# EAGLE design hamtonio (EAGLE 9.2.2)
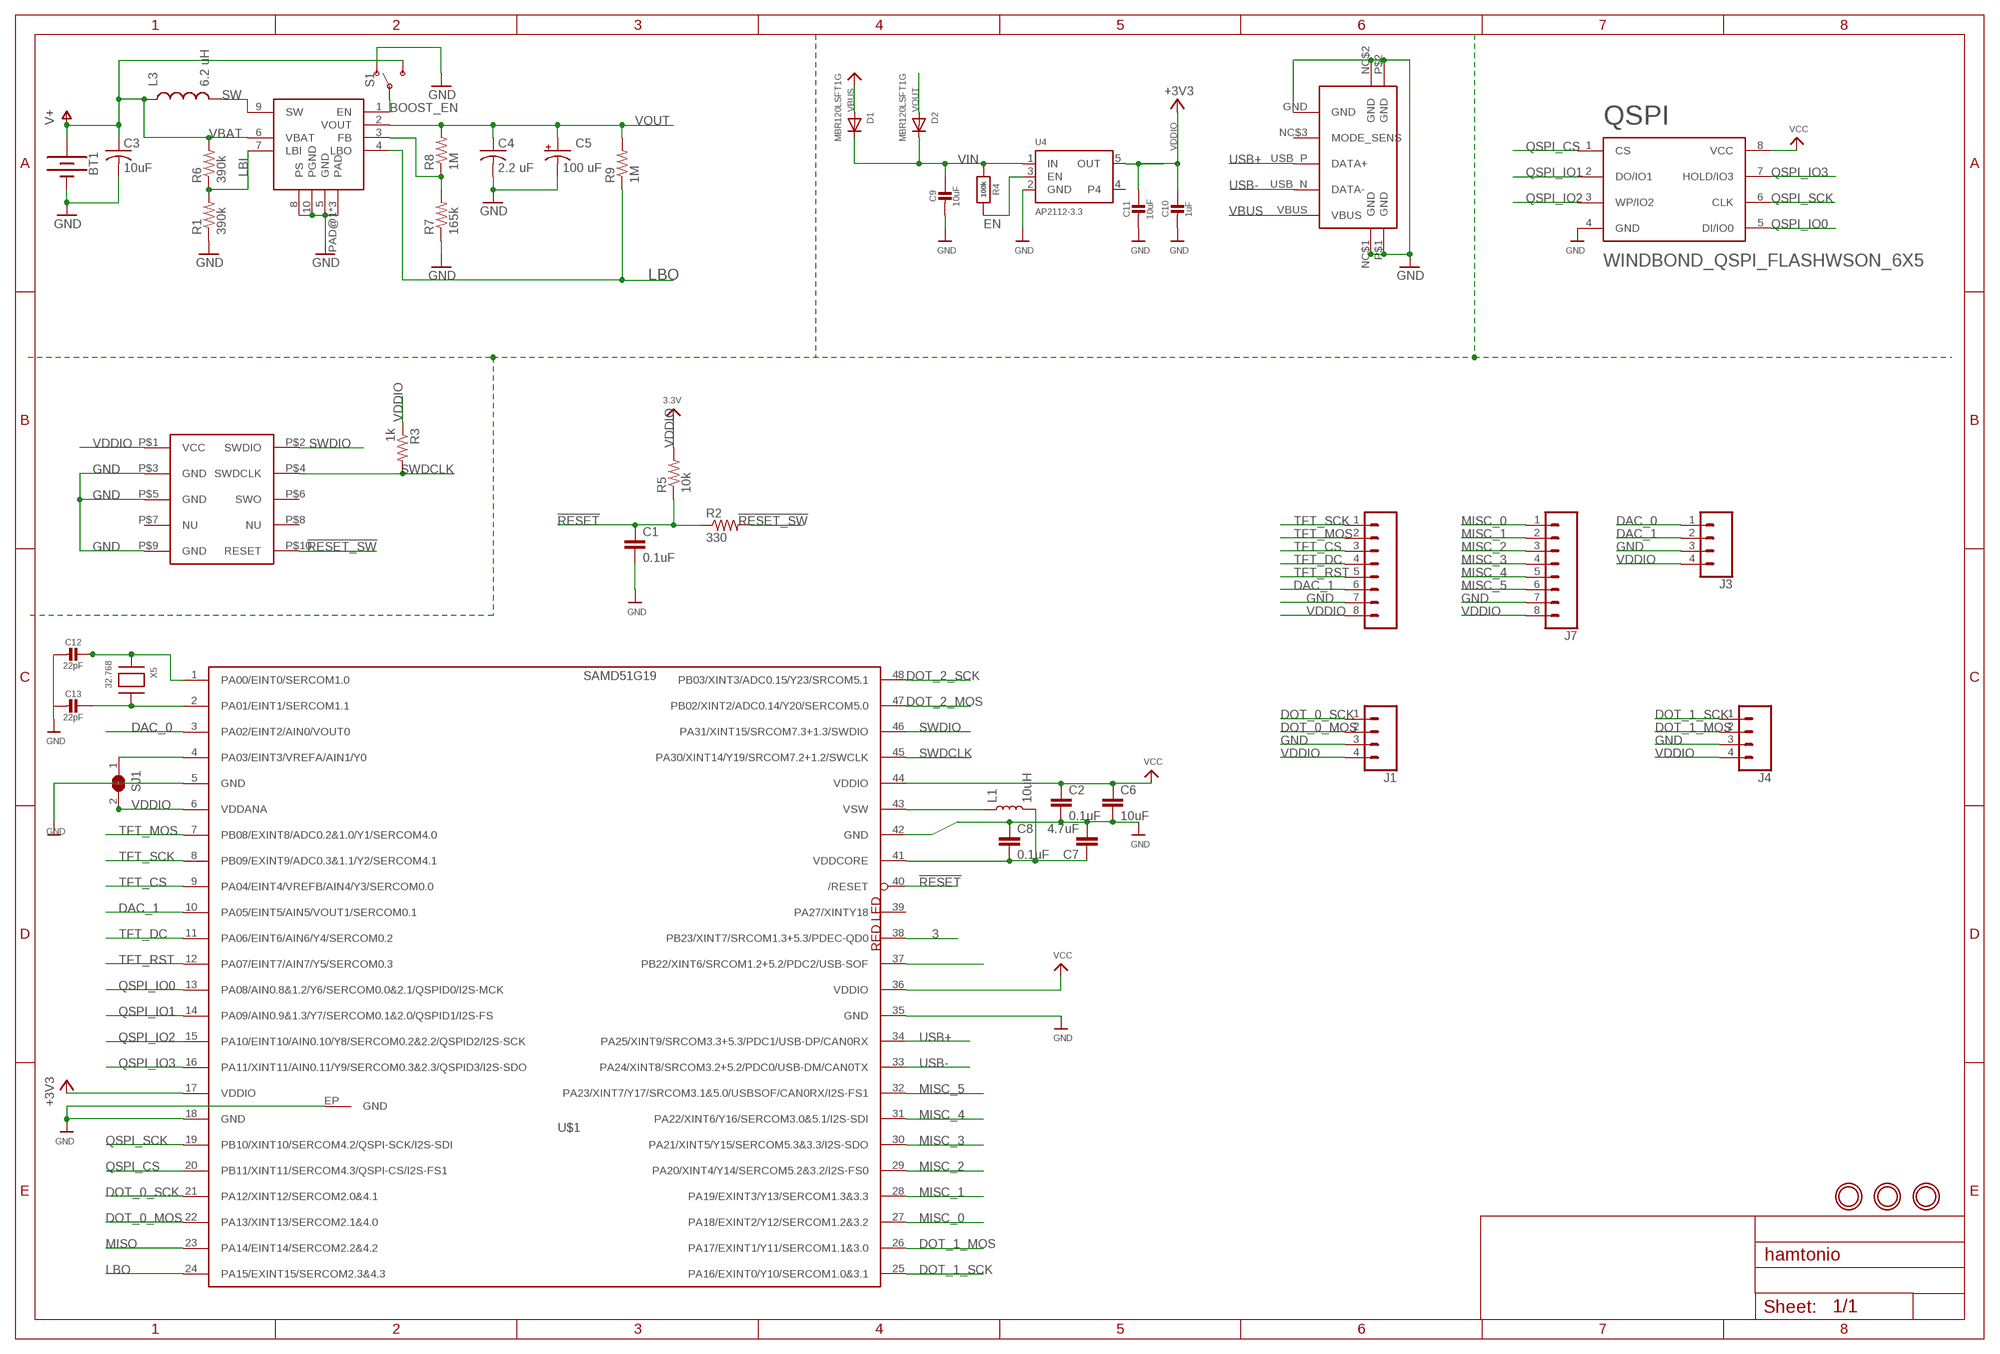
[diagram p0: schematic, sheet 1]

## Parts
BT1  BATTERYDUAL_AA_XX  [DUAL_AA]
C1  0.1uF  0.1UF-0603-25V-(+80/-20%)  [0603]
C2  0.1uF  0.1UF-0603-25V-(+80/-20%)  [0603]
C3  10uF  C-USC0805K  [C0805K]
C4  2.2 uF  C-USC0805K  [C0805K]
C5  100 uF  CPOL-USCT6032  [CT6032]
C6  10uF  10UF-0805-10V-10%  [0805]
C7  4.7uF  4.7UF0603  [0603]
C8  0.1uF  0.1UF-0603-25V-(+80/-20%)  [0603]
C9  10uF  CAP_CERAMIC0805-NOOUTLINE  [0805-NO]
C10  1uF  CAP_CERAMIC0603_NO  [0603-NO]
C11  10uF  CAP_CERAMIC0805-NOOUTLINE  [0805-NO]
C12  22pF  CAP_CERAMIC0603_NO  [0603-NO]
C13  22pF  CAP_CERAMIC0603_NO  [0603-NO]
D1  MBR120LSFT1G  DIODESOD-123  [SOD-123]
D2  MBR120LSFT1G  DIODESOD-123  [SOD-123]
J1  CONN_041X04_NO_SILK  [1X04_NO_SILK]
J3  CONN_041X04_NO_SILK  [1X04_NO_SILK]
J4  CONN_041X04_NO_SILK  [1X04_NO_SILK]
J6  CONN_08NO_SILK_FEMALE_PTH  [1X08_NO_SILK]
J7  CONN_08NO_SILK_FEMALE_PTH  [1X08_NO_SILK]
L1  10uH  1007_INDUCTOR  [1007_INDUCTOR]
L3  6.2 uH  INDUCTORSRU1038  [CDRH52D]
QSPI  WINDBOND_QSPI_FLASHWSON_6X5  [WSON_6X5MM]
R1  390k  R-US_R0603  [R0603]
R2  330  R-US_R0603  [R0603]
R3  1k  R-US_R0603  [R0603]
R4  100k  RESISTOR_0603_NOOUT  [0603-NO]
R5  10k  R-US_R0603  [R0603]
R6  390k  R-US_R0603  [R0603]
R7  165k  R-US_R0603  [R0603]
R8  1M  R-US_R0603  [R0603]
R9  1M  R-US_R0603  [R0603]
S1  SWITCH-SPDTSMD_C&K_JS  [SPDT_SMD]
SJ1  SOLDERJUMPERCLOSED  [SOLDERJUMPER_CLOSEDWIRE]
U4  AP2112-3.3  VREG_SOT23-5  [SOT23-5]
U$1  SAMD51G19  SAMD51G  [QFN-48]
U$2  SWD_HEADER  [AMPHENOL_SWD]
U$8  TPS61029  [TPS61029]
U$12  AMPHENOL_MICRO_USBAMPHENOL_MICRO_USB_BETTER  [BETTER_AMP_MICRO_USB]
U$22  MOUNTINGHOLE2.5  [MOUNTINGHOLE_2.5_PLATED]
U$34  MOUNTINGHOLE2.5  [MOUNTINGHOLE_2.5_PLATED]
U$39  MOUNTINGHOLE2.5  [MOUNTINGHOLE_2.5_PLATED]
X5  32.768  XTAL-3.2X1.5  [XTAL3215]

## Nets
3: U$1.38(PB23/XINT7/SRCOM1.3+5.3/PDEC-QD0)
!RESET: C1.1 R2.1 R5.1 U$1.40(/RESET)
!RESET_SW: R2.2 U$2.P$10(RESET)
AREF: SJ1.1 U$1.4(PA03/EINT3/VREFA/AIN1/Y0)
BOOST_EN: S1.P$2(P) S1.P$5(P) U$8.1(EN)
DAC_0: J3.1 U$1.3(PA02/EINT2/AIN0/VOUT0)
DAC_1: J3.2 J6.6 U$1.10(PA05/EINT5/AIN5/VOUT1/SERCOM0.1)
DOT_0_MOS: J1.2 U$1.22(PA13/XINT13/SERCOM2.1&4.0)
DOT_0_SCK: J1.1 U$1.21(PA12/XINT12/SERCOM2.0&4.1)
DOT_1_MOS: J4.2 U$1.26(PA17/EXINT1/Y11/SERCOM1.1&3.0)
DOT_1_SCK: J4.1 U$1.25(PA16/EXINT0/Y10/SERCOM1.0&3.1)
DOT_2_MOS: U$1.47(PB02/XINT2/ADC0.14/Y20/SERCOM5.0)
DOT_2_SCK: U$1.48(PB03/XINT3/ADC0.15/Y23/SRCOM5.1)
EN: R4.2 U4.3(EN)
FB: R7.2 R8.1 U$8.3(FB)
GND: BT1.V-(-) C1.2 C2.2 C3.2 C4.2 C5.- C6.2 C7.2 C8.1 C9.2 C10.2 C11.2 C12.2 C13.2 J1.3 J3.3 J4.3 J6.7 J7.7 QSPI.4(GND) R1.1 R7.1 S1.P$1(O) S1.P$6(O) U4.2(GND) U$1.5(GND) U$1.18(GND) U$1.35(GND) U$1.42(GND) U$1.EP(GND) U$2.P$3(GND) U$2.P$5(GND) U$2.P$9(GND) U$8.5(GND) U$8.8(PS) U$8.10(PGND) U$8.PAD@1(PAD) U$8.PAD@2(PAD) U$8.PAD@3(PAD) U$12.GND U$12.NC$1(GND) U$12.NC$2(GND) U$12.P$1(GND) U$12.P$2(GND)
LBI: R1.2 R6.1 U$8.7(LBI)
LBO: R9.1 U$1.24(PA15/EXINT15/SERCOM2.3&4.3) U$8.4(LBO)
MISC_0: J7.1 U$1.27(PA18/EXINT2/Y12/SERCOM1.2&3.2)
MISC_1: J7.2 U$1.28(PA19/EXINT3/Y13/SERCOM1.3&3.3)
MISC_2: J7.3 U$1.29(PA20/XINT4/Y14/SERCOM5.2&3.2/I2S-FS0)
MISC_3: J7.4 U$1.30(PA21/XINT5/Y15/SERCOM5.3&3.3/I2S-SDO)
MISC_4: J7.5 U$1.31(PA22/XINT6/Y16/SERCOM3.0&5.1/I2S-SDI)
MISC_5: J7.6 U$1.32(PA23/XINT7/Y17/SRCOM3.1&5.0/USBSOF/CAN0RX/I2S-FS1)
MISO: U$1.23(PA14/EINT14/SERCOM2.2&4.2)
N$3: U$1.37(PB22/XINT6/SRCOM1.2+5.2/PDC2/USB-SOF)
QSPI_CS: QSPI.1(CS) U$1.20(PB11/XINT11/SERCOM4.3/QSPI-CS/I2S-FS1)
QSPI_IO0: QSPI.5(DI/IO0) U$1.13(PA08/AIN0.8&1.2/Y6/SERCOM0.0&2.1/QSPID0/I2S-MCK)
QSPI_IO1: QSPI.2(DO/IO1) U$1.14(PA09/AIN0.9&1.3/Y7/SERCOM0.1&2.0/QSPID1/I2S-FS)
QSPI_IO2: QSPI.3(WP/IO2) U$1.15(PA10/EINT10/AIN0.10/Y8/SERCOM0.2&2.2/QSPID2/I2S-SCK)
QSPI_IO3: QSPI.7(HOLD/IO3) U$1.16(PA11/XINT11/AIN0.11/Y9/SERCOM0.3&2.3/QSPID3/I2S-SDO)
QSPI_SCK: QSPI.6(CLK) U$1.19(PB10/XINT10/SERCOM4.2/QSPI-SCK/I2S-SDI)
SW: L3.2 U$8.9(SW)
SWDCLK: R3.2 U$1.45(PA30/XINT14/Y19/SRCOM7.2+1.2/SWCLK) U$2.P$4(SWDCLK)
SWDIO: U$1.46(PA31/XINT15/SRCOM7.3+1.3/SWDIO) U$2.P$2(SWDIO)
TFT_CS: J6.3 U$1.9(PA04/EINT4/VREFB/AIN4/Y3/SERCOM0.0)
TFT_DC: J6.4 U$1.11(PA06/EINT6/AIN6/Y4/SERCOM0.2)
TFT_MOS: J6.2 U$1.7(PB08/EXINT8/ADC0.2&1.0/Y1/SERCOM4.0)
TFT_RST: J6.5 U$1.12(PA07/EINT7/AIN7/Y5/SERCOM0.3)
TFT_SCK: J6.1 U$1.8(PB09/EXINT9/ADC0.3&1.1/Y2/SERCOM4.1)
USB+: U$1.34(PA25/XINT9/SRCOM3.3+5.3/PDC1/USB-DP/CAN0RX) U$12.USB_P(DATA+)
USB-: U$1.33(PA24/XINT8/SRCOM3.2+5.2/PDC0/USB-DM/CAN0TX) U$12.USB_N(DATA-)
VBAT: BT1.V+(+) C3.1 L3.1 R6.2 S1.P$3(S) S1.P$4(S) U$8.6(VBAT) ; supply symbol labelled V+
VBUS: D1.A U$12.VBUS
VDDCORE: C7.1 C8.2 L1.P$2 U$1.41(VDDCORE)
VDDIO: C2.1 C6.1 C10.1 C11.1 J1.4 J3.4 J4.4 J6.8 J7.8 QSPI.8(VCC) R3.1 R5.2 SJ1.2 U4.5(OUT) U$1.6(VDDANA) U$1.17(VDDIO) U$1.36(VDDIO) U$1.44(VDDIO) U$2.P$1(VCC) ; supply symbol labelled VCC, +3V3, 3.3V
VIN: C9.1 D1.C D2.C R4.1 U4.1(IN)
VOUT: C4.1 C5.+ D2.A R8.2 R9.2 U$8.2(VOUT)
VSW: L1.P$1 U$1.43(VSW)
XOSC32_A: C12.1 U$1.1(PA00/EINT0/SERCOM1.0) X5.P$1
XOSC32_B: C13.1 U$1.2(PA01/EINT1/SERCOM1.1) X5.P$2
Unconnected: U4.4 U$1.39(PA27/XINTY18) U$2.P$6(SWO) U$2.P$7(NU) U$2.P$8(NU) U$12.NC$3(MODE_SENS)

## Notes on the sheet
- Dev Board Starter Kit
- RED LED

## Library data of the parts
BT1 = 00_bsiepert:BATTERY: Battery - Single Cell A variety of battery chemistries, sizes, and footprints. Device List: 20MM_PTH - Coin Cell Battery Holder - 20mm (PTH) <https://www.sparkfun.com/products/783> 6.8MM_PTH - Coin Cell Battery Holder - 6.8MM(SMD) <https://www.digikey.com/product-detail/en/seiko-instruments/MS621FE-FL11E/728-1057-ND/1889208?WT.srch=1&gclid=CNOQ5a6LzdQCFZS2wAodXCkE0g> 12MM_SMD - Coin Cell Battery Holder - 12mm (SMD) <https://www.sparkfun.com/products/10592> 12MM_PTH - Coin Cell Battery Holder - 12mm (PTH) <https://www.sparkfun.com/products/7948> 20MM_SMD - 20mm Coin Cell Battery Holder (SMD) (2 legs) Used on the Big Time Watch Kit <https://www.sparkfun.com/products/11734> 20MM_SMD_4LEGS - Coin Cell Battery Holder - 20mm (SMD) <https://www.sparkfun.com/products/11892> 20MM_SMD_4LEGS_OVERPASTE - Coin Cell Battery Holder - 20mm (SMD) <https://www.sparkfun.com/products/11892> (Over-paste on the legs) 24.5MM_PTH - Coin Cell Battery Holder - 24.5mm (PTH) <https://www.sparkfun.com/products/8863> 9V - 9V Battery Holder - PC Mount Used on the SparkFun SparkPunk Sound Kit <https://www.sparkfun.com/products/11177> and SparkFun SparkPunk Sequencer Kit <https://www.sparkfun.com/products/12707> 18650 - Battery Holder - 18650 (PTH) <https://www.sparkfun.com/products/13113> AA - Battery Holder - 1xAA (PTH) <https://www.sparkfun.com/products/7949> AAA - Battery Holder - 1xAAA (PTH) <https://www.sparkfun.com/products/12718> AA_KIT - Battery Holder - 1xAA (PTH) <https://www.sparkfun.com/products/7949> Special kit package - pads only have exposed copper on one side of the board. AAA_KIT - Battery Holder - 1xAAA (PTH) <https://www.sparkfun.com/products/12718> Special kit package - pads only have exposed copper on one side of the board.
C1 C2 C8 = SparkFun-Capacitors:0.1UF: 0.1µF ceramic capacitors A capacitor is a passive two-terminal electrical component used to store electrical energy temporarily in an electric field.; PROD_ID: CAP-00810
C3 C4 = resistor:C-US: CAPACITOR, American symbol
C5 = resistor:CPOL-US: POLARIZED CAPACITOR, American symbol
C6 = SparkFun-Capacitors:10UF: 10.0µF ceramic capacitors A capacitor is a passive two-terminal electrical component used to store electrical energy temporarily in an electric field.; PROD_ID: CAP-11330
C7 = SparkFun-Capacitors:4.7UF: 4.7µF ceramic capacitors A capacitor is a passive two-terminal electrical component used to store electrical energy temporarily in an electric field.; PROD_ID: CAP-08280
C9-C13 = microbuilder:CAP_CERAMIC: Ceramic Capacitors For new designs, use the packages preceded by an '_' character since they are more reliable: The following footprints should be used on most boards: _0402 - Standard footprint for regular board layouts _0603 - Standard footprint for regular board layouts _0805 - Standard footprint for regular board layouts _1206 - Standard footprint for regular board layouts For extremely tight-pitch boards where space is at a premium, the following 'micro-pitch' footprints can be used (smaller pads, no silkscreen outline, etc.): _0402MP - Micro-pitch footprint for very dense/compact boards _0603MP - Micro-pitch footprint for very dense/compact boards _0805MP - Micro-pitch footprint for very dense/compact boards _1206MP - Micro-pitch footprint for very dense/compact boards
D1 D2 = adafruit:DIODE: Diode SMADIODE - SMA Surface Mount Package 20V 1A Schottky Diode Digikey: 641-1014-6-ND DO-1N4148 - Through Hole Small Current Diode SOD-123 20V 1 A (.5mV Vf) Schottky Diode - Digikey: MBRX120TPMSCT-ND SOD-323 10V 570mA (.38mV Vf, 3ns) Schottky Diode - Digikey: ZLLS410CT-ND SOD-523 30V 30mA Schottky Diode (RB751S-40TE61) - Digikey: RB751S-40TE61CT-ND SOT23-R/W - SOT23 Package (R = Solder Paste/Reflow Ovens, W = Hand-Soldering) BAT54Film 40V 300mA - Digikey: 497-7162-1-ND
J1 J3 J4 = SparkFun-Connectors:CONN_04: Multi connection point. Often used as Generic Header-pin footprint for 0.1 inch spaced/style header connections On any of the 0.1 inch spaced packages, you can populate with these: Break Away Headers - Straight <https://www.sparkfun.com/products/116> (PRT-00116) Break Away Male Headers - Right Angle <https://www.sparkfun.com/products/553> (PRT-00553) Female Headers <https://www.sparkfun.com/products/115> (PRT-00115) Break Away Headers - Machine Pin <https://www.sparkfun.com/products/117> (PRT-00117) Break Away Female Headers - Swiss Machine Pin <https://www.sparkfun.com/products/743> (PRT-00743) For SCREWTERMINALS and SPRING TERMINALS visit here: Screw Terimnals on SparkFun.com <https://www.sparkfun.com/search/results?term=Screw+Terminals> (5mm/3.5mm/2.54mm spacing) This device is also useful as a general connection point to wire up your design to another part of your project. Our various solder wires solder well into these plated through hole pads. Hook-Up Wire - Assortment (Stranded, 22 AWG) <https://www.sparkfun.com/products/11375> (PRT-11375) Hook-Up Wire - Assortment (Solid Core, 22 AWG) <https://www.sparkfun.com/products/11367> (PRT-11367) View the entire wire category on our website here <https://www.sparkfun.com/categories/141> Special notes: Molex polarized connector foot print use with SKU : PRT-08231 with associated crimp pins and housings. 1MM SMD Version SKU: PRT-10208; PROD_ID: CONN-09696
J6 J7 = SparkFun-Connectors:CONN_08: Multi connection point. Often used as Generic Header-pin footprint for 0.1 inch spaced/style header connections On any of the 0.1 inch spaced packages, you can populate with these: Break Away Headers - Straight <https://www.sparkfun.com/products/116> (PRT-00116) Break Away Male Headers - Right Angle <https://www.sparkfun.com/products/553> (PRT-00553) Female Headers <https://www.sparkfun.com/products/115> (PRT-00115) Break Away Headers - Machine Pin <https://www.sparkfun.com/products/117> (PRT-00117) Break Away Female Headers - Swiss Machine Pin <https://www.sparkfun.com/products/743> (PRT-00743) Arduino Stackable Header - 8 Pin <https://www.sparkfun.com/products/9279> (PRT-09279) For SCREWTERMINALS and SPRING TERMINALS visit here: Screw Terimnals on SparkFun.com <https://www.sparkfun.com/search/results?term=Screw+Terminals> (5mm/3.5mm/2.54mm spacing) This device is also useful as a general connection point to wire up your design to another part of your project. Our various solder wires solder well into these plated through hole pads. Hook-Up Wire - Assortment (Stranded, 22 AWG) <https://www.sparkfun.com/products/11375> (PRT-11375) Hook-Up Wire - Assortment (Solid Core, 22 AWG) <https://www.sparkfun.com/products/11367> (PRT-11367) View the entire wire category on our website here <https://www.sparkfun.com/categories/141> Special notes: Molex polarized connector foot print use with SKU : PRT-08231 with associated crimp pins and housings. 1MM SMD Version SKU: PRT-10208 NOTES ON THE VARIANTS LOCK and LOCK_LONGPADS... This footprint was designed to help hold the alignment of a through-hole component (i.e. 6-pin header) while soldering it into place. You may notice that each hole has been shifted either up or down by 0.005 of an inch from it's more standard position (which is a perfectly straight line). This slight alteration caused the pins (the squares in the middle) to touch the edges of the holes. Because they are alternating, it causes a "brace" to hold the component in place. 0.005 has proven to be the perfect amount of "off-center" position when using our standard breakaway headers. Although looks a little odd when you look at the bare footprint, once you have a header in there, the alteration is very hard to notice. Also,if you push a header all the way into place, it is covered up entirely on the bottom side.; PROD_ID: CONN-08438
L1 = 00_bsiepert:1007_INDUCTOR
L3 = Inductor-SumidaCDRH5D28:INDUCTOR: Inductors Basic Inductor/Choke - 0603 and 1206. Footprints are not proven and vary greatly between part numbers.
QSPI = 00_bsiepert:WINDBOND_QSPI_FLASH
R1-R3 R5-R9 = adafruit:R-US_: RESISTOR, American symbol
R4 = microbuilder:RESISTOR: Resistors For new designs, use the packages preceded by an '_' character since they are more reliable: The following footprints should be used on most boards: _0402 - Standard footprint for regular board layouts _0603 - Standard footprint for regular board layouts _0805 - Standard footprint for regular board layouts _1206 - Standard footprint for regular board layouts For extremely tight-pitch boards where space is at a premium, the following 'micro-pitch' footprints can be used (smaller pads, no silkscreen outline, etc.): _0402MP - Micro-pitch footprint for very dense/compact boards _0603MP - Micro-pitch footprint for very dense/compact boards _0805MP - Micro-pitch footprint for very dense/compact boards _1206MP - Micro-pitch footprint for very dense/compact boards
S1 = 00_bsiepert:SWITCH-SPDT: Single Pole, Double Throw (SPDT) Switch Single-pole, double-throw (SPDT) switch. Variant Overview SMD-AYZ0202 Surface Mount DPDT Switch <https://www.sparkfun.com/products/597> (COM-00597) Used on e.g. LilyPad Arduino USB - ATmega32U4 Board <https://www.sparkfun.com/products/12049> PTH-11.6X4.0MM SPDT Mini Power Switch <https://www.sparkfun.com/products/102> (COM-00102) Used on e.g. SparkFun Simon Says - Through-Hole Soldering Kit <https://www.sparkfun.com/products/10547> (KIT-10547) PTH-11.6X4.0MM-KIT KIT version of SPDT Mini Power Switch - Simplifies soldering by removing tStop of switch pins - only one side can be soldered. PTH-11.6X4.0MM-LOCK LOCK version of SPDT Mini Power Switch - Offset pins hold switch in place for easier soldering. SMD-RIGHT-ANGLE Surface Mount Right Angle Switch <https://www.sparkfun.com/products/10860> (COM-10860) Used on e.g. SparkFun ESP8266 Thing <https://www.sparkfun.com/products/13231>
SJ1 = 00_bsiepert:SOLDERJUMPER: SMD Solder JUMPER Solder the two pads together to create a connection, or remove the solder to break it. REFLOW - Use this footprint for solder paste and reflow ovens. WAVE - Use this footprint for hand-soldering (larger pads). CLOSED - Has a trace between the two pads to ensure it is closed by default. The trace needs to be cut to disable the jumper, and can be closed again by creating a solder bridge between the two pads.
U4 = microbuilder:VREG_SOT23-5: SOT23-5 Fixed Voltage Regulators Part Current Out V Out V In V Dropout θJA (°C/W) TJ (°C) Digikey Part No. ADP121 150mA 3.3V 3.4-5.5V 0.09V @ 150mA -- -- ADP121-AUJZ33R7CT-ND ADP121 150mA 3.0V 3.1-5.5V 0.09V @ 150mA -- -- ADP121-AUJZ30R7CT-ND ADP122 300mA 3.3V 3.4-5.5V 0.085V @ 300mA -- -- ADP122AUJZ-3.3-R7CT-ND ADP1712 300mA 3.3V 3.5-5.5V 0.17V @ 300mA -- -- ADP1712AUJZ-3.3-R7TR-ND AP7311 (Low Cost) 150mA 3.3V 3.5-6V 0.15V @ 150mA -- -- AP7311-33WG-7DICT-ND LD39015M18R 150mA 1.8V 1.9V-5.5V 0.08V @ 100mA -- -- 497-6977-1-ND LP2985A-33DBVR 150mA 3.3V 3.3-16V 0.28V @ 150mA 206 150 296-18479-1-ND MCP1824T-3302E/OT 300mA 3.3V 3.5V-6V 0.2V @ 300mA -- -- MCP1824T-3302E/OTCT-ND MIC5205-2.5YM5 TR 150mA 2.5V 2.7-16V 0.165V @ 150mA -- -- 576-1257-2-ND MIC5205-3.0YM5 TR 150mA 3.0V 3.2V-16V 0.165V @ 150mA -- -- 576-1258-2-ND MIC5205-3.3YM5 TR 150mA 3.3V 3.5V-16V 0.165V @ 150mA -- -- 576-1259-2-ND TPS780330220 150mA 3.3V+2.2V 3.6-5.5V 250mV Max -- -- 296-23332-1-ND TDA3663/N1,135 100mA 3.3V 3.5-45V 0.18V @ 50mA -- -- 568-5343-1-ND Max operating temp can be calculated using θJA, TJ (max junction temperature), and power in watts. Set the "Maximum Ambient Temperature" until it reaches TJ ("Max Junction Temperature"), which is the absolute limit for safe use of the regulator: Heat Sink Temperature Calculator <http://www.daycounter.com/Calculators/Heat-Sink-Temperature-Calculator.phtml> For example, With 12V source into a 3.3V LP2985 and a 30mA load, we are dissipating (12V-3.3V) * 0.03A = 0.261W. With a θJA of 206 °C/W, a TJ of 150°C, and 261mW we can safely use the chip without a heat sink up to 75°C (=147.1°C Junction Temperature).
U$1 = 00_bsiepert:SAMD51G
U$2 = 00_bsiepert:SWD_HEADER
U$8 = 00_bsiepert:TPS61029
U$12 = 00_bsiepert:AMPHENOL_MICRO_USB
U$22 U$34 U$39 = microbuilder:MOUNTINGHOLE: Mounting Hole For #2 screws (0.086"/2.18mm width, 0.094"/2.4mm hole) use 2.5mm; BOM: EXCLUDE
X5 = adafruit2:XTAL: Low cost SMT crystals, no capacitors included http://www.ladyada.net/library/eagle

## Net classes
1 vcc: width 0.254 mm

## Board
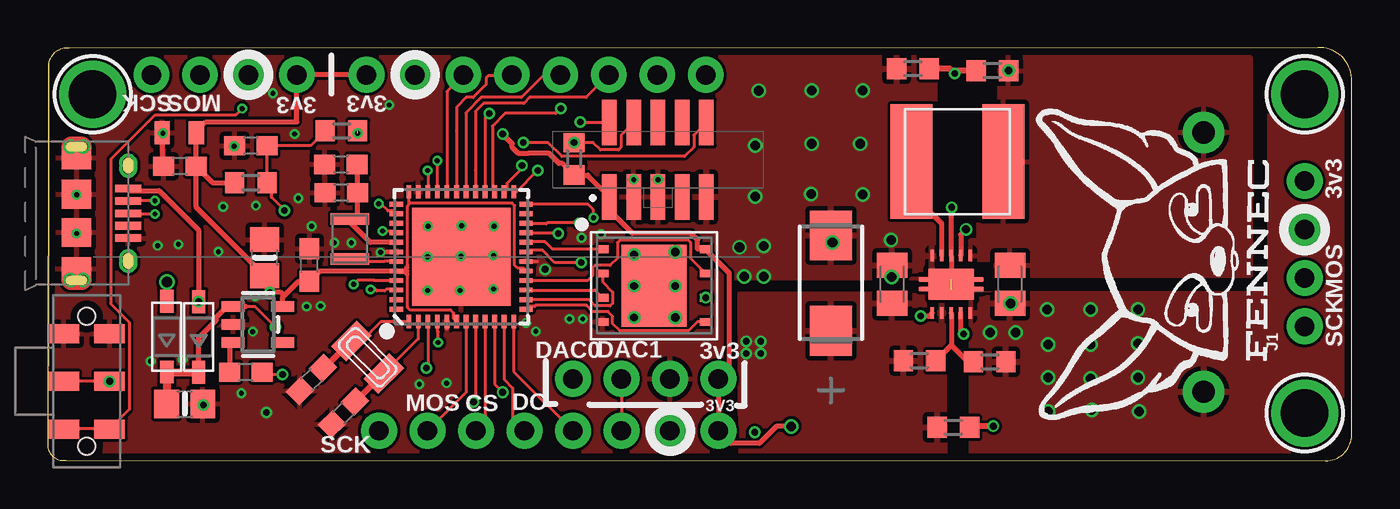
[diagram p1: board, top side]
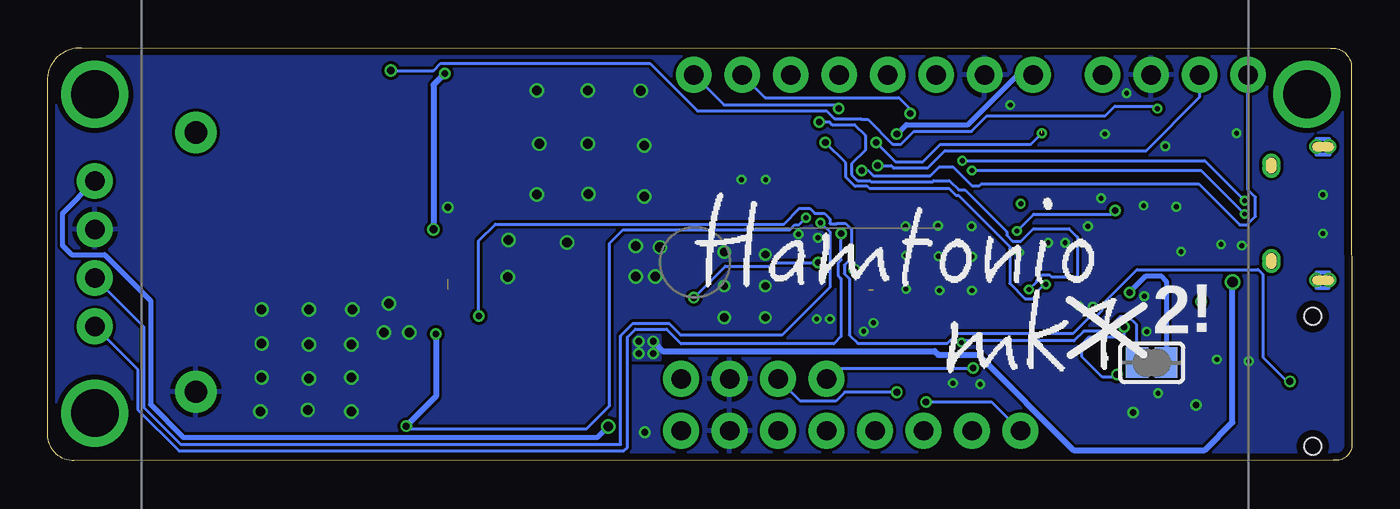
[diagram p2: board, bottom side, seen from below]

Size 68.34 x 21.64 mm. Coordinates in mm from the lower left corner, seen from the top.
Outline: 0.03,20.73 0,0.76 arc90 0.97,0.03 66.95,0 arc90 68.34,1.37 68.34,20.04 arc90 66.55,21.64 1.12,21.62 arc90 0.03,20.73
Copper layers (1*16): Top 0.035559375mm / dielectric 1.6mm / Bottom 0.035559375mm
Design rules "oshpark-2layer-tented *": minimum track width 6mil, minimum drill 10mil, track to track 6mil, track to pad 6mil, pad to pad 6mil, via to via 6mil, smd to smd 6mil, copper to edge 15mil, drill to drill 6mil, minimum pad ring 5mil, minimum via ring 5mil, stop-mask expansion 2.5mil, vias tented up to drill 20mil, thermal gap 10mil

### Footprints (pad centres in the part's own frame; a part is rotated, then mirrored left to right if it is on the bottom)
DUAL_AA = drill 1.17 pad 2.184: V+ 6.795,26.16; V- -6.795,26.16
0603 = smd 1.1 x 1: 1 -0.85,0; 2 0.85,0
C0805K = smd 1.3 x 1.6: 1 -1,0; 2 1,0
CT6032 = smd 2.6 x 2.2: + 2.5,0; - -2.5,0
0805 = smd 0.8 x 1.2: 1 -0.9,0; 2 0.9,0
0805-NO = smd 1.3 x 1.5: 1 -0.95,0; 2 0.95,0
0603-NO = smd 1.1 x 1: 1 -0.85,0; 2 0.85,0
SOD-123 = smd 1.2 x 0.7: A 1.85,0; C -1.85,0
1X04_NO_SILK = drill 1.016 pad 1.88: 1 0,0; 2 2.54,0; 3 5.08,0; 4 7.62,0
1X08_NO_SILK = drill 1.016 pad 1.88: 1 0,0; 2 2.54,0; 3 5.08,0; 4 7.62,0; 5 10.16,0; 6 12.7,0; 7 15.24,0; 8 17.78,0
1007_INDUCTOR = smd 0.6 x 2: P$1 -1.05,0; P$2 1.05,0
CDRH52D = smd 2.2 x 6: 1 -2.4,0; 2 2.4,0
WSON_6X5MM = smd 0.6 x 0.4: 1 -2.7,1.905; 2 -2.7,0.635; 3 -2.7,-0.635; 4 -2.7,-1.905; 5 2.7,-1.905; 6 2.7,-0.635; 7 2.7,0.635; 8 2.7,1.905 | smd 3.4 x 4.3: PAD 0,0
R0603 = smd 1 x 1.1: 1 -0.85,0; 2 0.85,0
SPDT_SMD = smd 1 x 1.6: P$1 -2.5,1.2; P$2 0,1.2; P$3 2.5,1.2; P$4 2.5,-1.2; P$5 0,-1.2; P$6 -2.5,-1.2 | hole 0.9: 3.4,0; -3.4,0
SOLDERJUMPER_CLOSEDWIRE = smd 1.168 x 1.6: 1 -0.762,0; 2 0.762,0 | smd 0.635 x 0.203: WIRE 0,0
SOT23-5 = smd 0.55 x 1.2: 1 -0.95,-1.3; 2 0,-1.3; 3 0.95,-1.3; 4 0.95,1.3; 5 -0.95,1.3
QFN-48 = smd 0.7 x 0.25: 1 -3.4,2.75; 2 -3.4,2.25; 3 -3.4,1.75; 4 -3.4,1.25; 5 -3.4,0.75; 6 -3.4,0.25; 7 -3.4,-0.25; 8 -3.4,-0.75; 9 -3.4,-1.25; 10 -3.4,-1.75; 11 -3.4,-2.25; 12 -3.4,-2.75; 25 3.4,-2.75; 26 3.4,-2.25; 27 3.4,-1.75; 28 3.4,-1.25; 29 3.4,-0.75; 30 3.4,-0.25; 31 3.4,0.25; 32 3.4,0.75; 33 3.4,1.25; 34 3.4,1.75; 35 3.4,2.25; 36 3.4,2.75 | smd 0.25 x 0.7: 13 -2.75,-3.4; 14 -2.25,-3.4; 15 -1.75,-3.4; 16 -1.25,-3.4; 17 -0.75,-3.4; 18 -0.25,-3.4; 19 0.25,-3.4; 20 0.75,-3.4; 21 1.25,-3.4; 22 1.75,-3.4; 23 2.25,-3.4; 24 2.75,-3.4; 37 2.75,3.4; 38 2.25,3.4; 39 1.75,3.4; 40 1.25,3.4; 41 0.75,3.4; 42 0.25,3.4; 43 -0.25,3.4; 44 -0.75,3.4; 45 -1.25,3.4; 46 -1.75,3.4; 47 -2.25,3.4; 48 -2.75,3.4 | smd 5.15 x 5.15: EP 0,0
AMPHENOL_SWD = smd 0.76 x 2.4: P$1 -2.54,-1.95; P$2 -2.54,1.95; P$3 -1.27,-1.95; P$4 -1.27,1.95; P$5 0,-1.95; P$6 0,1.95; P$7 1.27,-1.95; P$8 1.27,1.95; P$9 2.54,-1.95; P$10 2.54,1.95
TPS61029 = smd 0.6 x 0.24: 1 -1.5,1; 2 -1.5,0.5; 3 -1.5,0; 4 -1.5,-0.5; 5 -1.5,-1; 6 1.5,-1; 7 1.5,-0.5; 8 1.5,0; 9 1.5,0.5; 10 1.5,1 | smd 1.65 x 2.4: PAD@1 0,0 | smd 0.25 x 3.4: PAD@2 -0.25,0; PAD@3 0.25,0
BETTER_AMP_MICRO_USB = smd 0.4 x 1.35: GND 1.3,2.7; NC$3 0.65,2.7; USB_N -0.65,2.7; USB_P 0,2.7; VBUS -1.3,2.7 | smd 1.5 x 1.55: NC$1 -1,0; NC$2 1,0 | smd 1.2 x 1.55: P$1 -2.9,0; P$2 2.9,0 | drill 0.5: P$3 -3.5,0.325; P$4 -3.5,-0.325; P$5 3.5,-0.325; P$6 3.5,0.325 | drill 0.55 pad 0.95: P$7 -2.65,2.7; P$8 -2.35,2.7; P$9 2.35,2.7; P$10 2.65,2.7
MOUNTINGHOLE_2.5_PLATED = drill 2.5 pad 3.2: P$1 0,0
XTAL3215 = smd 1.1 x 1.9: P$1 1.2,0; P$2 -1.2,0

### Placement (x,y rotation side)
BT1  34.42,10.41 90 bottom
C1  10.65,16.51 180 top
C2  13.71,10.25 90 top
C3  50.43,9.25 270 top
C4  44.25,9.25 90 top
C5  41.04,9.31 270 top
C6  6.9,17.18 180 top
C7  15.38,14.05 180 top
C8  15.37,15.53 0 top
C9  7.18,2.98 0 top
C10  6.93,15.44 180 top
C11  11.37,10.64 90 top
C12  13.81,4.26 225 top
C13  15.5,2.52 225 top
D1  7.91,6.49 90 top
D2  6.24,6.5 90 top
J1  65.87,7.04 90 top
J3  27.52,4.29 0 top
J4  5.44,20.22 0 top
J6  17.36,1.57 0 top
J7  34.48,20.22 180 top
L1  15.84,11.62 90 top
L3  47.67,15.68 180 top
QSPI  31.78,9.18 0 top
R1  45.34,20.55 0 top
R2  15.4,17.28 0 top
R3  27.59,15.82 90 top
R4  10.38,4.64 180 top
R5  10.65,14.57 180 top
R6  49.51,20.45 0 top
R7  49.37,5.18 180 top
R8  45.68,5.25 180 top
R9  47.46,1.75 180 top
S1  2.05,4.17 270 top
SJ1  10.49,5.14 0 bottom
U4  11.02,7.14 270 top
U$1  21.67,10.69 90 top
U$2  31.98,15.77 0 top
U$8  47.35,9.25 90 top
U$12  1.51,12.97 270 top
U$22  65.87,2.5 270 top
U$34  65.87,19.2 270 top
U$39  2.35,19.2 270 top
X5  16.76,5.43 135 top

### Tracks (layer width: path | path; a pad name or v marks a point on that pad's centre or on a via)
3  (via drill 0.25)
  Top 0.152: U$1.38 18.13,13.09 17.83,13.09 17.45,13.47 v17.35,13.47
!RESET  (via drill 0.25, 0.35)
  Top 0.152: U$1.40 18.18,12.04 v17.55,12.04 | v12.41,13.12 11.73,13.8 11.73,14.33 R5.1 C1.1 13.77,16.51 R2.1
  Bottom 0.152: v17.55,12.04 16.67,12.93 12.6,12.93 v12.41,13.12
!RESET_SW  (via drill 0.25, 0.35)  (1 unrouted)
  Top 0.152: U$2.P$10 33.86,17.06 33.86,16.43 33.38,15.95 26.94,15.95 26.21,16.68 v24.92,16.68
  Bottom 0.152: v24.92,16.68 23.9,15.66 22.48,15.66 21.56,16.57 16.83,16.57 v16.25,17.16
AREF  (via drill 0.25)
  Top 0.152: v20.46,6.2 20.46,6.75 20.44,6.77 20.44,7.25 20.41,7.27
  Top 0.2: 20.41,7.27 20.42,7.28 U$1.4
  Bottom 0.152: SJ1.1 11.28,5.17 11.28,7.12 11.71,7.55 12.15,7.55 12.9,6.8 14.05,6.8 14.56,6.29 20.37,6.29 v20.46,6.2
BOOST_EN  (via drill 0.35)
  Top 0.152: S1.P$2 S1.P$5
  Top 0.254: v45.75,7.59 45.77,7.57 46.17,7.57 U$8.1
  Bottom 0.152: v45.75,7.59 45.75,11.53 44.87,12.41 29.76,12.41 28.95,13.22 28.4,13.22 28.14,12.96 27.64,12.96 27.36,12.68 27.36,12.45 27.33,12.42 27,12.42 26.98,12.44 26.54,12.44 26.23,12.13 26.23,10.62 26.59,10.25 26.59,9.81 26.33,9.55 26.33,6.59 25.89,6.15 21.19,6.15 20.66,6.68 14.59,6.68 13.67,7.61 13.37,7.61 13.08,7.89 13.08,8.19 11.26,10.01 4.93,10.01 4.92,10.03 4.66,9.77 4.66,5.44 3.39,4.17 S1.P$2
  other vias: 3.25,4.17
DAC_0  (via drill 0.35)
  Top 0.152: U$1.3 19.92,4.95 v19.84,4.86
  Bottom 0.152: J3.1 26.95,4.86 v19.84,4.86
DAC_1  (via drill 0.35)
  Top 0.152: U$1.10 23.42,4.01 v23.84,3.59 | J3.2 J6.6
  Bottom 0.152: v23.84,3.59 26.57,3.59 27.04,3.12 28.9,3.12 J3.2
DOT_0_MOS  (via drill 0.25)
  Top 0.152: v27.84,12.48 26.18,12.48 26.13,12.42 25.1,12.42 U$1.22
  Bottom 0.152: J1.2 63.31,7.02 63.31,2.81 61.36,0.86 38.32,0.86 38.32,6.51 38.33,6.51 38.33,6.54 37.67,7.2 35.78,7.2 35.18,6.6 29.85,6.6 27.33,9.12 27.33,11.97 v27.84,12.48
DOT_0_SCK  (via drill 0.35)
  Top 0.152: v26.76,11.91 25.1,11.91 U$1.21
  Bottom 0.152: J1.1 63.62,4.79 63.62,2.69 61.45,0.52 38.14,0.52 37.96,0.7 37.96,6.48 37.55,6.9 35.91,6.9 35.14,6.13 27.14,6.13 26.76,6.51 26.76,9.55 26.9,9.69 26.9,10.38 26.76,10.52 v26.76,11.91
DOT_1_MOS  (via drill 0.35)
  Top 0.152: U$1.26 24.07,14.24 24.07,14.54 24.86,15.33 v24.86,15.47
  Bottom 0.152: J4.2 7.98,19.05 10.77,16.26 21.32,16.26 22.22,15.35 24.03,15.35 24.15,15.47 v24.86,15.47
DOT_1_SCK  (via drill 0.35)
  Top 0.152: U$1.25 24.56,14.09 v25.68,15.21
  Bottom 0.152: J4.1 5.44,14.21 5.04,13.82 5.04,12.8 5.49,12.36 5.87,12.36 8.03,14.52 19.41,14.52 19.51,14.41 19.91,14.41 20.9,15.41 21.62,15.41 22.09,14.94 25.08,14.94 25.35,15.21 v25.68,15.21
EN
  Top 0.254: U4.3 9.53,6 R4.2
FB
  Top 0.254: U$8.3 47.35,6.06 | 47.35,6.06 R8.1 | R7.2 48.23,5.18 47.35,6.06
GND  (via drill 0.25, 0.35, 0.4, 0.45, 0.5)  (2 unrouted)
  Top 0.152: U$1.18 25.66,10.44
  Top 0.254: U$1.5 20.92,6.97 | C6.2 6,15.52 C10.2 | U$1.42 v17.44,10.92 | U$1.EP v19.9,10.69 | U$8.PAD@1 U$8.8 47.35,13.26 v47.37,13.28
  Top 0.305: C3.2 49.84,8.25
  other vias: 10.15,3.54 14.3,8.12 13.57,8.09 19.93,12.29 23.38,12.29 23.36,9 19.9,8.93 23.36,10.76 21.66,10.72 21.69,12.32 21.61,8.93 10.75,6.77 5.4,5.22 7.08,5.31 42.57,16.61 42.7,13.94 8.16,2.92 11.46,2.54 52.43,2.59 42.7,19.41 37.25,19.39 37.08,16.52 44.19,11.57 52.43,4.37 54.65,4.31 57.13,4.37 57.19,2.59 54.72,2.66 57.13,7.93 54.65,7.93 52.37,7.93 52.43,6.09 40.03,19.41 40.03,16.61 40,13.98 37.08,13.86 36.25,11.19 30.73,10.81 32.89,10.94 30.73,9.16 32.89,9.16 32.89,7.51 30.73,7.51 37.05,1.5 26.06,10.03 13.13,13.75 13.83,12.29 11.8,19.25 17.9,18.64 9.77,16.48 12.94,17.12 1.51,13.94 1.51,11.91 10.87,8.62 8.94,10.96 9.2,13.31 10.91,13.37 6.85,11.34 5.77,11.28 6.04,17.16 29,11.87 27.98,11.68 30.71,14.73 31.98,14.73 25.07,7.23 25.58,6.78 27.35,7.43 28.04,7.43 15.03,11.43 15.92,11.43 37.52,11.25 37.52,9.67 36.51,9.67 54.65,6.09 57.13,6.15 49.38,6.72 50.72,6.72 50.46,8.24 44.22,9.63 41.13,11.43 20.9,4.07 19.48,4.01
  pour Top: 0.03,21.97 0.03,-1.04 35.84,-1.04 35.84,21.97
  pour Top: 33.47,9.63 46.5,9.63 46.5,22.78 33.47,22.78
  pour Top: 64.04,22.58 64.04,8.74 48.42,8.74 48.42,-0.15 68.74,-0.15 68.74,22.58
  pour Bottom: 35.52,4.99 35.52,-1.23 69.24,-1.23 69.24,4.99
  pour Bottom: 35.65,6.96 38.13,6.96 38.13,0.48 68.74,0.48 68.74,23.34 -0.67,23.34 -0.67,-0.79 35.65,-0.79
LBI  (via drill 0.35, 0.4)
  Top 0.254: v48.12,12.13 47.85,11.86 U$8.7
  Top 0.305: R6.1 47.68,20.45 v47.53,20.29 47.27,20.55 R1.2
  Bottom 0.305: v47.53,20.29 48.12,19.7 v48.12,12.13
LBO  (via drill 0.25, 0.35)
  Top 0.152: v28.6,12.74 28.6,13.15 28.31,13.44 U$1.24
  Top 0.254: v47.99,6.64 47.85,6.78 U$8.4
  Top 0.305: v49.56,1.82 48.38,1.82 R9.1
  Bottom 0.152: v49.56,1.82 49.43,1.69 40.1,1.69 38.89,2.9 38.89,11.4 38.19,12.1 29.45,12.1 29.2,12.36 28.98,12.36 v28.6,12.74
  Bottom 0.305: v47.99,6.64 47.99,3.38 v49.56,1.82
MISC_0  (via drill 0.35)
  Top 0.152: v26.89,18.45 26.64,18.2 23.97,18.2 23.31,17.54 23.31,14.21 U$1.27
  Bottom 0.152: J7.1 32.91,18.64 26.89,18.64 v26.89,18.45
MISC_1  (via drill 0.35)
  Top 0.152: v23.14,18.2 22.92,17.98 U$1.28
  Bottom 0.152: J7.2 30.75,19.02 23.74,19.02 23.14,18.43 v23.14,18.2
MISC_2
  Top 0.152: J7.3 28.22,19.04 25.26,19.04 24.96,18.73 22.85,18.73 22.42,18.3 22.42,15.25 | 22.42,15.25 | 22.42,15.25 U$1.29
MISC_3
  Top 0.152: J7.4 26.01,20.22 24.83,19.04 22.72,19.04 21.92,18.23 U$1.30
MISC_4
  Top 0.152: U$1.31 21.42,17.28 21.43,17.28 21.43,18.53 21.94,19.04 22.29,19.04 22.98,19.72 22.98,20.07 23.08,20.17 24.27,20.17 J7.5
MISC_5
  Top 0.152: J7.6 20.92,19.36 U$1.32
QSPI_CS
  Top 0.152: QSPI.1 26.44,11.09 26.06,11.47 25.09,11.47 U$1.20
QSPI_IO0
  Top 0.152: QSPI.5 34.05,7.28 33.57,6.8 29.98,6.8 29.61,7.18 29.61,7.57 29.37,7.81 28.56,7.81 28.23,8.14 25.57,8.14 25.52,8.09 25.22,8.09 U$1.13
QSPI_IO1
  Top 0.152: QSPI.2 29.08,9.37 29.61,8.84 29.61,8.25 29.47,8.12 28.68,8.12 28.36,8.44 U$1.14
QSPI_IO2  (1 unrouted)
  Top 0.152: 25.35,8.99 25.3,8.94 | U$1.15 28.68,8.94 QSPI.3
QSPI_IO3
  Top 0.152: QSPI.7 33.71,10.59 33.71,11.43 33.57,11.56 29.98,11.56 29.85,11.43 29.85,10.62 29.47,10.25 28.68,10.25 28.55,10.11 28.55,9.7 28.29,9.44 U$1.16
QSPI_SCK  (via drill 0.35)
  Top 0.152: v27.97,10.39 26.57,10.39 25.94,11.02 25.15,11.02 U$1.19
  Bottom 0.152: v27.97,10.39 30.29,10.39 30.48,10.2 32.82,10.2 QSPI.6
  other vias: 34.48,8.55
SW
  Top 0.254: L3.2 45.27,14.01 46.84,12.45 U$8.9
SWDCLK  (via drill 0.25, 0.35)
  Top 0.152: U$2.P$4 30.05,17.06 30.05,16.43 29.92,16.29 28.97,16.29 28.59,16.67 R3.2 | U$1.45 17.14,9.44 17.13,9.46 16.25,9.46 v16.03,9.25
  Bottom 0.152: R3.2 26.52,15.6 26.52,14.87 26.03,14.38 25.38,14.38 25.26,14.26 21.1,14.26 20.73,13.89 20.59,13.89 17.87,11.17 17.92,11.12 17.92,9.29 17.13,8.5 16.73,8.5 16.44,8.78 16.44,8.92 16.03,9.33 v16.03,9.25
  other vias: 27.59,16.67
SWDIO  (via drill 0.25, 0.35)
  Top 0.152: U$1.46 18.24,8.98 17.73,8.98 17.66,8.91 17.26,8.91 17.19,8.98 v16.93,8.98 | U$2.P$2 27.94,17.72 v27.91,17.75
  Bottom 0.152: v27.91,17.75 27.37,17.75 27.24,17.62 26.05,17.62 25.49,17.06 25.49,16.28 26.21,15.56 26.21,14.99 25.9,14.68 25.25,14.68 25.2,14.63 21.96,14.63 21.91,14.68 21.09,14.68 20.6,14.2 20.28,14.2 18.09,12 18.09,11.82 17.77,11.51 17.33,11.51 16.68,12.17 14.82,12.17 14.38,11.72 14.38,9.63 15.73,9.63 15.83,9.73 16.23,9.73 16.51,9.45 16.51,9.39 v16.93,8.98
TFT_CS
  Top 0.152: U$1.9 22.92,2.05 J6.3
TFT_DC
  Top 0.152: U$1.11 23.92,4.26 24.37,3.81 24.37,2.19 J6.4
TFT_MOS
  Top 0.152: U$1.7 21.92,3.59 J6.2
TFT_RST
  Top 0.152: U$1.12 24.42,4.68 J6.5
TFT_SCK  (via drill 0.35)
  Top 0.152: U$1.8 22.42,3.19 v22.32,3.09
  Bottom 0.152: v22.32,3.09 18.88,3.09 J6.1
USB+  (via drill 0.25)
  Top 0.152: v19.9,15.21 19.92,15.2 U$1.34 | v5.62,12.93 4.25,12.93 U$12.USB_P
  Bottom 0.152: v5.62,12.93 7.9,15.21 v19.9,15.21
USB-  (via drill 0.25)
  Top 0.152: U$1.33 20.42,15.71 v20.41,15.72 | v5.62,13.63 5.61,13.62 U$12.USB_N
  Bottom 0.152: v5.62,13.63 7.71,15.72 v20.41,15.72
VBAT  (via drill 0.25, 0.4)
  Top 0.152: v10.19,18.45 9.85,18.11 5.61,18.11 3.31,15.81 3.31,8.23 4.28,7.26 4.28,2.69 S1.P$3 2.43,1.67 2.42,1.67 1.67,1.67 S1.P$4
  Top 0.254: C3.1 50.26,10.08
  Top 0.305: C3.1 50.91,10.25
  Bottom 0.152: R6.2 48.12,20.45 47.75,20.83 36.78,20.83 34.29,18.34 27.53,18.34 27.11,17.92 25.74,17.92 25.71,17.89 25.37,17.89 24.06,16.59 23.62,16.59 22.95,17.26 19.93,17.26 19.12,18.07 12.92,18.07 12.41,18.58 10.32,18.58 v10.19,18.45
  other vias: 50.36,20.45
  pour Top: 48.39,10.57 49.66,10.57 49.69,10.54 49.69,9.73 63.05,9.73 63.05,21.11 62.54,21.11 49.86,21.11 49.86,13.82 49.86,12.8 48.77,12.8 48.77,11.53 48.36,11.53 48.36,10.59
VBUS  (via drill 0.35)
  Top 0.254: U$12.VBUS 4.32,14.16 5.84,14.16 7.91,12.09 D1.A
  Bottom 0.406: D1.A
  other vias: 7.91,8.34
VDDCORE
  Top 0.152: L1.P$2 15.89,12.67 16.23,13.02
  Top 0.254: 16.23,13.02 C7.1 C8.2 | U$1.41 16.91,11.44 15.84,12.51 L1.P$2
VDDIO  (via drill 0.35, 0.5)
  Top 0.152: U$1.6 21.28,7.44 21.28,7.74 21.12,7.89 19,7.89 18.87,8.03 18.87,9.74 18.82,9.79 | U$1.36 18.92,13.42 | U$1.17 24.93,10.09 24.63,10.09 24.48,10.24 24.48,13.36 24.34,13.5 19,13.5 18.92,13.42 | 18.82,10.12 18.82,10.19 18.86,10.24 18.86,13.36 18.92,13.42
  Top 0.254: 18.82,9.94 U$1.44 14.26,9.94 C2.1 13.14,9.4 12.38,8.64 | 18.82,9.79 18.82,9.94 | 18.82,9.94 18.82,10.12 | U4.5 12.32,8.57 12.38,8.64 | 12.38,8.64 12.2,8.83 v11.65,8.83 11.37,9.22 C11.1 7.78,13.28 C10.1 | v38.96,1.81 38.18,1.81 37.29,0.92 35.8,0.92 J6.8 J3.4 35.72,4.86 35.72,9.85 QSPI.8 34.06,11.09 34.06,11.57 33.72,11.92 30.64,11.92 29.44,13.12 U$2.P$1 28.29,14.97 R3.1 26.97,15.59 26.8,15.59 26.28,16.1 25.17,16.1 25.16,16.09 24.68,16.09 24.34,16.43 24.34,16.62 v23.84,17.12 | 7.78,17.16 C6.1 7.78,17.16 | 7.78,17.16 7.78,17.25 8.28,17.75 13.06,17.75 J4.4 J7.8 | R5.2 8.65,14.57 C10.1 | C10.1 7.78,17.16
  Bottom 0.254: SJ1.2 9.73,9.42 9.97,9.66 10.82,9.66 v11.65,8.83 | v23.84,17.12 23.34,17.62 20.11,17.62 17.51,20.22 J7.8 | J1.4 67.57,12.97 67.57,11.28 67.09,10.8 65.37,10.8 62.96,8.39 62.96,2.96 61.23,1.23 39.54,1.23 v38.96,1.81
VIN  (via drill 0.35)
  Top 0.152: R4.1 11.35,4.52 v12.31,4.52 | 10.38,8.09 10.85,8.09 v11.93,7.02
  Top 0.254: 7.9,4.65 D1.C 7.91,6.44 8.84,7.37 8.84,7.53 9.4,8.09 U4.1 10.38,8.09
  Top 0.406: 7.9,4.65 D2.C 6.24,3 C9.1
  Bottom 0.152: v12.31,4.52 12.45,4.38 13.07,4.38 14.15,5.46 14.15,6.11 13.77,6.49 11.93,6.49 11.93,6.94 v11.93,7.02
VOUT  (via drill 0.35, 0.55)
  Top 0.305: v6.25,9.37 D2.A
  Bottom 0.305: v6.25,9.37 6.25,2.02 7.71,0.56 14.59,0.56 19.58,5.55 21.67,5.55 21.87,5.75 36.1,5.75 v36.6,6.26
  other vias: 37.37,5.63 37.37,6.26 36.6,5.63
  pour Top: 36.3,8.73 46.95,8.73 47,0.18 36.35,0.18
  pour Bottom: 36.22,6.58 37.81,6.58 37.81,5.31 36.22,5.31
VSW
  Top 0.152: U$1.43 17.65,10.44 17.64,10.44 15.97,10.44 L1.P$1
XOSC32_A
  Top 0.152: U$1.1 17.46,7.29 16.44,6.28 X5.P$1
  Top 0.305: X5.P$1 14.49,4.86 C12.1
XOSC32_B
  Top 0.152: U$1.2 19.42,6.4 X5.P$2
  Top 0.305: X5.P$2 16.14,3.12 C13.1

### Text on the board
tPlace: SCK | MOS | 3v3 | 3v3 | 3v3 | MOS | SCK | DAC0 | DAC1 | 3v3 | MOS | DC | 3V3 | CS | SCK
bPlace: ! | 2
tValues: RST